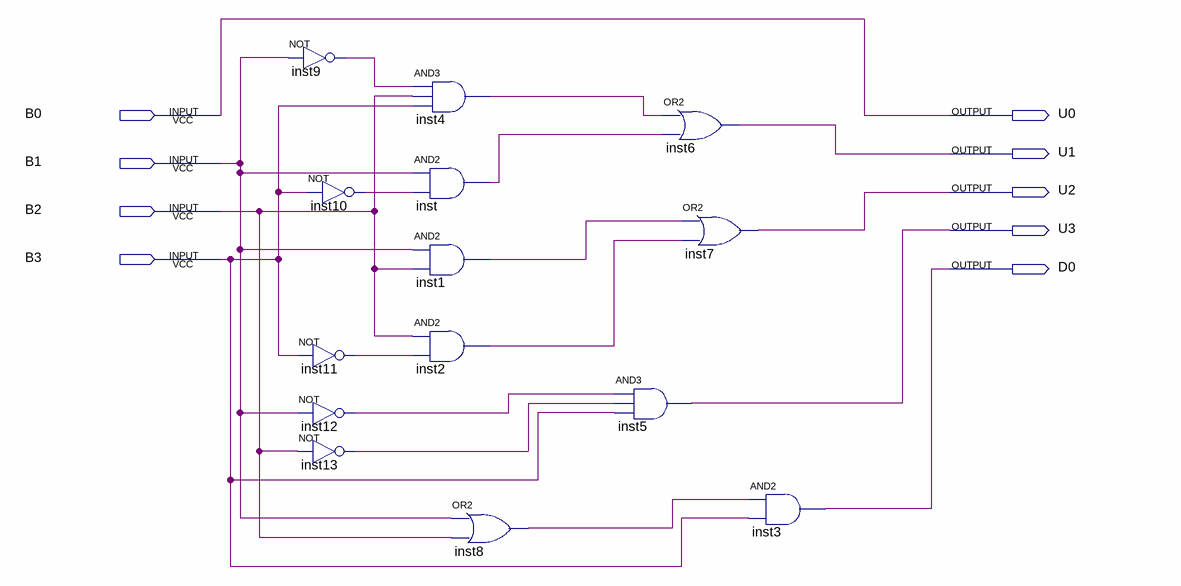
[diagram p0: schematic sheet]
// Quartus schematic Comparador.bdf as structural Verilog: 14 symbols, 9 pins
module Comparador (
  input  B0,
  input  B1,
  input  B2,
  input  B3,
  output U0,
  output U1,
  output U2,
  output U3,
  output D0
);

  wire inst1_out, inst2_out, inst4_out, inst8_out, inst9_out, inst10_out, inst11_out, inst12_out, inst13_out,
       inst_out;

  not inst9 (inst9_out, B1);
  not inst11 (inst11_out, B3);
  not inst12 (inst12_out, B1);
  not inst13 (inst13_out, B2);
  not inst10 (inst10_out, B3);
  and inst4 (inst4_out, inst9_out, B2, B3);
  and inst (inst_out, B1, inst10_out);
  and inst1 (inst1_out, B1, B2);
  and inst2 (inst2_out, B2, inst11_out);
  or inst8 (inst8_out, B1, B2);
  or inst6 (U1, inst4_out, inst_out);
  or inst7 (U2, inst1_out, inst2_out);
  and inst5 (U3, inst12_out, inst13_out, B3);
  and inst3 (D0, inst8_out, B3);

  assign U0 = B0;
endmodule
